# Altium schematic sheet LC Agregation Boards.SchDoc: Communication and Aggregation boards
size A4; Revision: 1; SheetNumber: 1; Version: 1.0; Variant: Variant; Modification: Mod; Project: Light Control; PageSetup: Record=PageOptions|CenterHorizontal=True|CenterVertical=True|PrintScale=0.97|XCorrection=1.00|YCorrection=1.00|PrintKind=1|BorderSize=5000000|LeftOffset=0|BottomOffset=0|Orientation=2|PaperLength=2970|PaperWidth=2100|Scale=100|PaperSource=7|PrintQuality=-4|MediaType=1|DitherType=10|PaperKind=A4|PrintScaleMode=1
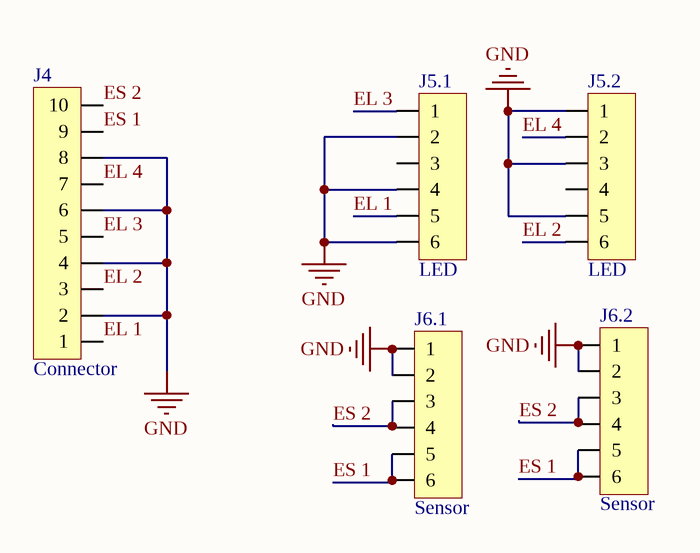
[diagram p0: LC Agregation Boards.SchDoc]

## Parts
J4  Connector  [LINE 2.54 x 10D (2 x 5) - BH]
J5.1  LED  [LINE 2.54 x 6D (2 x 3)]
J5.2  LED  [LINE 2.54 x 6D (2 x 3)]
J6.1  Sensor  [LINE 2.54 x 6D (2 x 3)]
J6.2  Sensor  [LINE 2.54 x 6D (2 x 3)]

## Nets
GND: J4.2 J4.4 J4.6 J4.8 J5.1.2 J5.1.4 J5.1.6 J5.2.1 J5.2.3 J5.2.5 J6.1.1 J6.1.2 J6.2.1 J6.2.2
EL 1: J4.1 J5.1.5
EL 2: J4.3 J5.2.6
EL 3: J4.5 J5.1.1
EL 4: J4.7 J5.2.2
ES 1: J4.9 J6.1.5 J6.1.6 J6.2.5 J6.2.6
ES 2: J4.10 J6.1.3 J6.1.4 J6.2.3 J6.2.4

Not connected (* = marked no-connect by the designer): J5.1 3; J5.2 4

## Notes on the sheet
- Ver:
- Rev:
- Sheet
- of
- File:

## Library data of the parts
J4 = PLD-10 (2 x 5): Vert, Dbl line, Male
J5.1 J5.2 J6.1 J6.2 = PLD-6 (2 x 3): Vert, Dbl line, Male